# Altium schematic sheet Sheet2.SchDoc
size A4
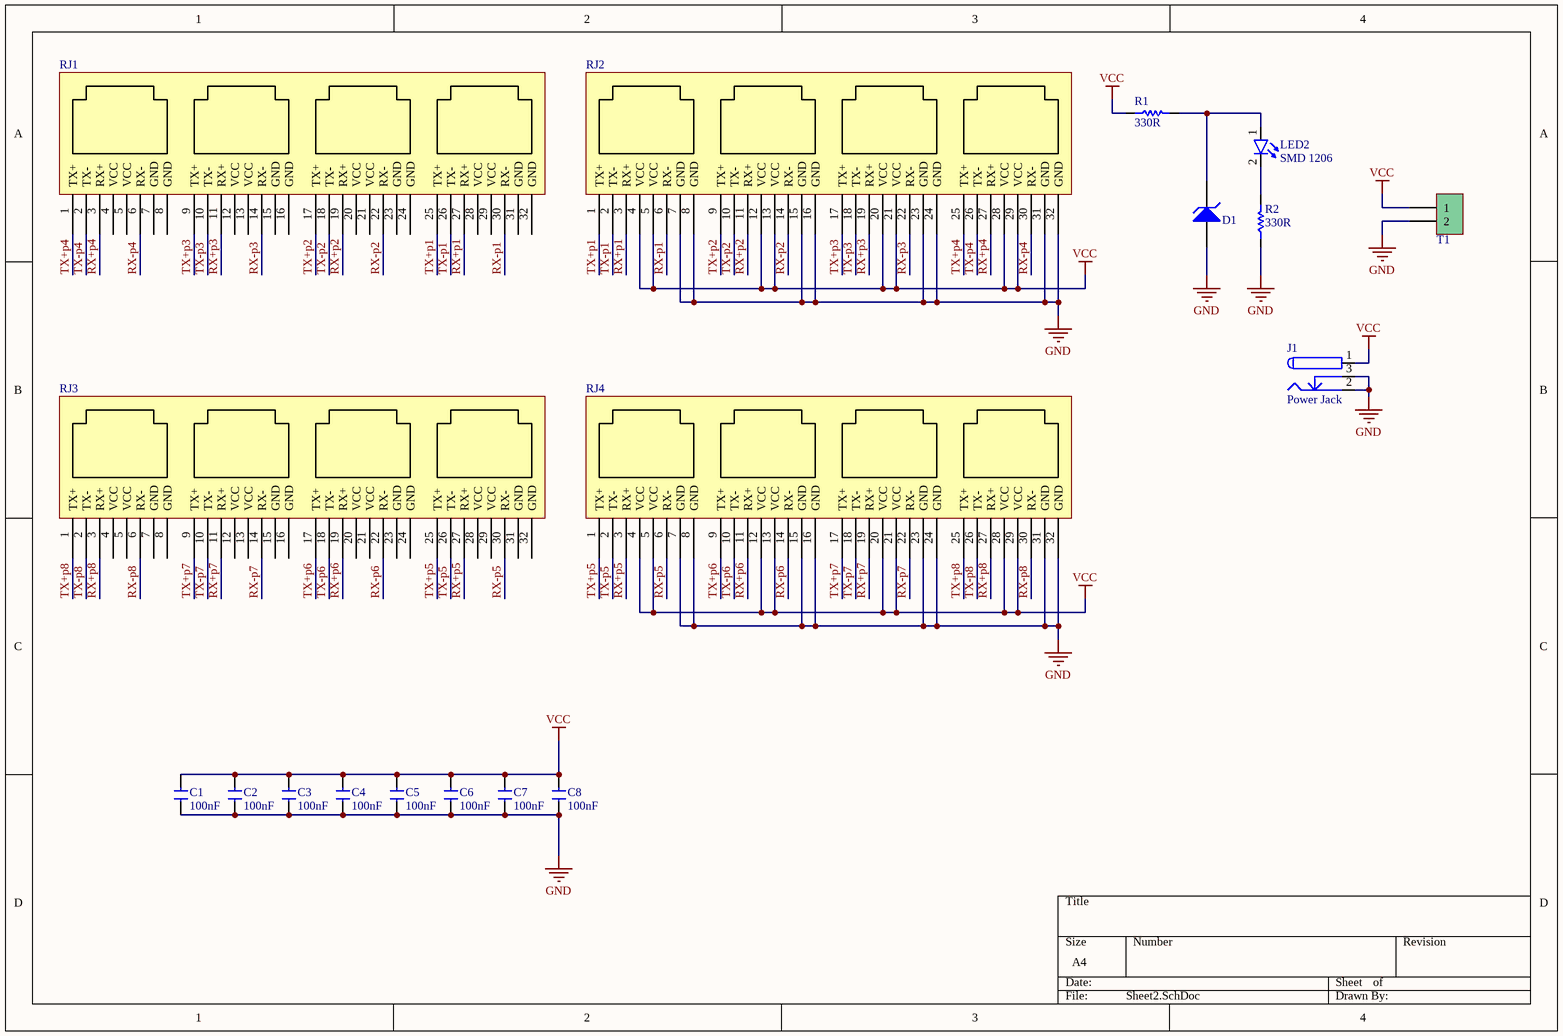
[diagram p0: Sheet2.SchDoc]

## Parts
C1  Capacitor SMD  [1206 Capacitor]  (value not drawn)
C2  Capacitor SMD  [1206 Capacitor]  (value not drawn)
C3  Capacitor SMD  [1206 Capacitor]  (value not drawn)
C4  Capacitor SMD  [1206 Capacitor]  (value not drawn)
C5  Capacitor SMD  [1206 Capacitor]  (value not drawn)
C6  Capacitor SMD  [1206 Capacitor]  (value not drawn)
C7  Capacitor SMD  [1206 Capacitor]  (value not drawn)
C8  Capacitor SMD  [1206 Capacitor]  (value not drawn)
D1  Diode Zener  [Diode 1W]  (value not drawn)
J1  Power Jack  [Power Jack]
LED2  Size: SMD 1206  [LED-5mm]  (hidden comment: Red)
R1  330R  [Res-(1/2)]
R2  330R  [RES 1206 (3216X08L)]
RJ1  (no value)  [rj45-w57-4]
RJ2  (no value)  [rj45-w57-4]
RJ3  (no value)  [rj45-w57-4]
RJ4  (no value)  [rj45-w57-4]
T1  Phoenix terminal  [phoenix terminal 2]  (value not drawn)

## Nets
GND: C1.1 C2.1 C3.1 C4.1 C5.1 C6.1 C7.1 C8.1 D1.1(A) J1.2 J1.3 R2.1 RJ2.7(GND) RJ2.8(GND) RJ2.15(GND) RJ2.16(GND) RJ2.23(GND) RJ2.24(GND) RJ2.31(GND) RJ2.32(GND) RJ4.7(GND) RJ4.8(GND) RJ4.15(GND) RJ4.16(GND) RJ4.23(GND) RJ4.24(GND) RJ4.31(GND) RJ4.32(GND) T1.2
VCC: C1.2 C2.2 C3.2 C4.2 C5.2 C6.2 C7.2 C8.2 J1.1 R1.1 RJ2.4(VCC) RJ2.5(VCC) RJ2.12(VCC) RJ2.13(VCC) RJ2.20(VCC) RJ2.21(VCC) RJ2.28(VCC) RJ2.29(VCC) RJ4.4(VCC) RJ4.5(VCC) RJ4.12(VCC) RJ4.13(VCC) RJ4.20(VCC) RJ4.21(VCC) RJ4.28(VCC) RJ4.29(VCC) T1.1
RX+p1: RJ1.27(RX+) RJ2.3(RX+)
RX+p2: RJ1.19(RX+) RJ2.11(RX+)
RX+p3: RJ1.11(RX+) RJ2.19(RX+)
RX+p4: RJ1.3(RX+) RJ2.27(RX+)
RX+p5: RJ3.27(RX+) RJ4.3(RX+)
RX+p6: RJ3.19(RX+) RJ4.11(RX+)
RX+p7: RJ3.11(RX+) RJ4.19(RX+)
RX+p8: RJ3.3(RX+) RJ4.27(RX+)
RX-p1: RJ1.30(RX-) RJ2.6(RX-)
RX-p2: RJ1.22(RX-) RJ2.14(RX-)
RX-p3: RJ1.14(RX-) RJ2.22(RX-)
RX-p4: RJ1.6(RX-) RJ2.30(RX-)
RX-p5: RJ3.30(RX-) RJ4.6(RX-)
RX-p6: RJ3.22(RX-) RJ4.14(RX-)
RX-p7: RJ3.14(RX-) RJ4.22(RX-)
RX-p8: RJ3.6(RX-) RJ4.30(RX-)
TX+p1: RJ1.25(TX+) RJ2.1(TX+)
TX+p2: RJ1.17(TX+) RJ2.9(TX+)
TX+p3: RJ1.9(TX+) RJ2.17(TX+)
TX+p4: RJ1.1(TX+) RJ2.25(TX+)
TX+p5: RJ3.25(TX+) RJ4.1(TX+)
TX+p6: RJ3.17(TX+) RJ4.9(TX+)
TX+p7: RJ3.9(TX+) RJ4.17(TX+)
TX+p8: RJ3.1(TX+) RJ4.25(TX+)
TX-p1: RJ1.26(TX-) RJ2.2(TX-)
TX-p2: RJ1.18(TX-) RJ2.10(TX-)
TX-p3: RJ1.10(TX-) RJ2.18(TX-)
TX-p4: RJ1.2(TX-) RJ2.26(TX-)
TX-p5: RJ3.26(TX-) RJ4.2(TX-)
TX-p6: RJ3.18(TX-) RJ4.10(TX-)
TX-p7: RJ3.10(TX-) RJ4.18(TX-)
TX-p8: RJ3.2(TX-) RJ4.26(TX-)
NetD1_2: D1.2(K) LED2.1(A) R1.2
NetLED2_2: LED2.2(K) R2.2

Not connected (* = marked no-connect by the designer): RJ1 4(VCC) 5(VCC) 7(GND) 8(GND) 12(VCC) 13(VCC) 15(GND) 16(GND) 20(VCC) 21(VCC) 23(GND) 24(GND) 28(VCC) 29(VCC) 31(GND) 32(GND); RJ3 4(VCC) 5(VCC) 7(GND) 8(GND) 12(VCC) 13(VCC) 15(GND) 16(GND) 20(VCC) 21(VCC) 23(GND) 24(GND) 28(VCC) 29(VCC) 31(GND) 32(GND)

## Notes on the sheet
- (in symbol Capacitor SMD) 100nF

## Library data of the parts
D1 = Diode Zener: Zener Diode; Designer: Saeid Jorablo; Company: E.P.I.L; Voltage: 12V; Design Date: 2011/11/02
J1 = Power Jack: Designer: Saeid Jorablo; Company: Personal; Project Name: Laser; Adding Date: 10/21/2009
LED2 = LED: Designer: Saeid Jorablo; Organazation: ControTec; Adding Date: 1387/12/22; Color: Red
R1 R2 = Resistor: Tolerance: 5%; Power: 1/8 W; Value: 330R
RJ1-RJ4 = RJ45-w57-4
T1 = Phoenix terminal 2: Terminal 2 Pin; Designer: Seyed Mohsen Ghasemain; E-mail: picpars@gmail.com; ComponentLinkURL: www.picpars.com